# EAGLE schematic ArithSlice (EAGLE 6.5.0)
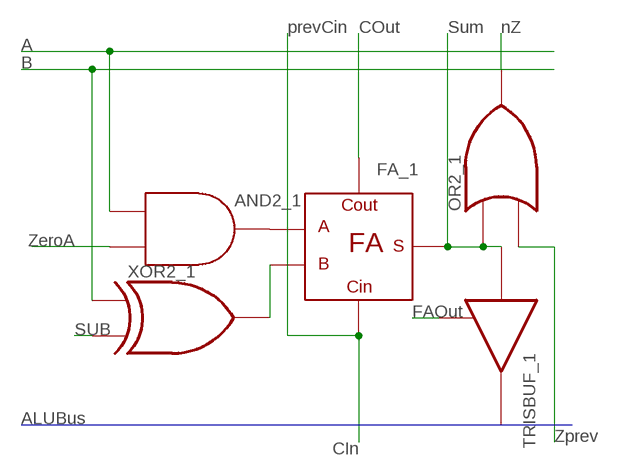
[diagram p0: schematic, sheet 1]

## Parts
AND2_1  AND2  [3PIN]
FA_1  FULLADDER  [5PIN]
OR2_1  OR2  [3PIN]
TRISBUF_1  TRISBUF  [3PIN]
XOR2_1  XOR2  [3PIN]

## Nets
N$13: AND2_1.P$3(O) FA_1.P$1(A)
N$14: FA_1.P$2(B) XOR2_1.P$3(O)
N$15: XOR2_1.P$2(I1)
N$16: FA_1.P$4(COUT)
N$17: TRISBUF_1.P$3
N$18: FA_1.P$5(S) OR2_1.P$1(I0) TRISBUF_1.P$1(I)
N$19: OR2_1.P$2(I1)
N$20: OR2_1.P$3(O)
N$23: XOR2_1.P$1(I0)
N$24: AND2_1.P$1(A)
N$25: FA_1.P$3(CIN)
Unconnected: AND2_1.P$2(I1) TRISBUF_1.P$2(O)

## Buses
B$1

## Notes on the sheet
- prevCin | COut | Sum | nZ
- A
- B
- ZeroA
- FAOut
- SUB
- ALUBus
- CIn | Zprev

## Library data of the parts
AND2_1 = c035u:AND2
FA_1 = c035u:FULLADDER
OR2_1 = c035u:OR2
TRISBUF_1 = c035u:TRISBUF
XOR2_1 = c035u:XOR2